# EAGLE design i2c-sensor-bridge (EAGLE 7.4.0)
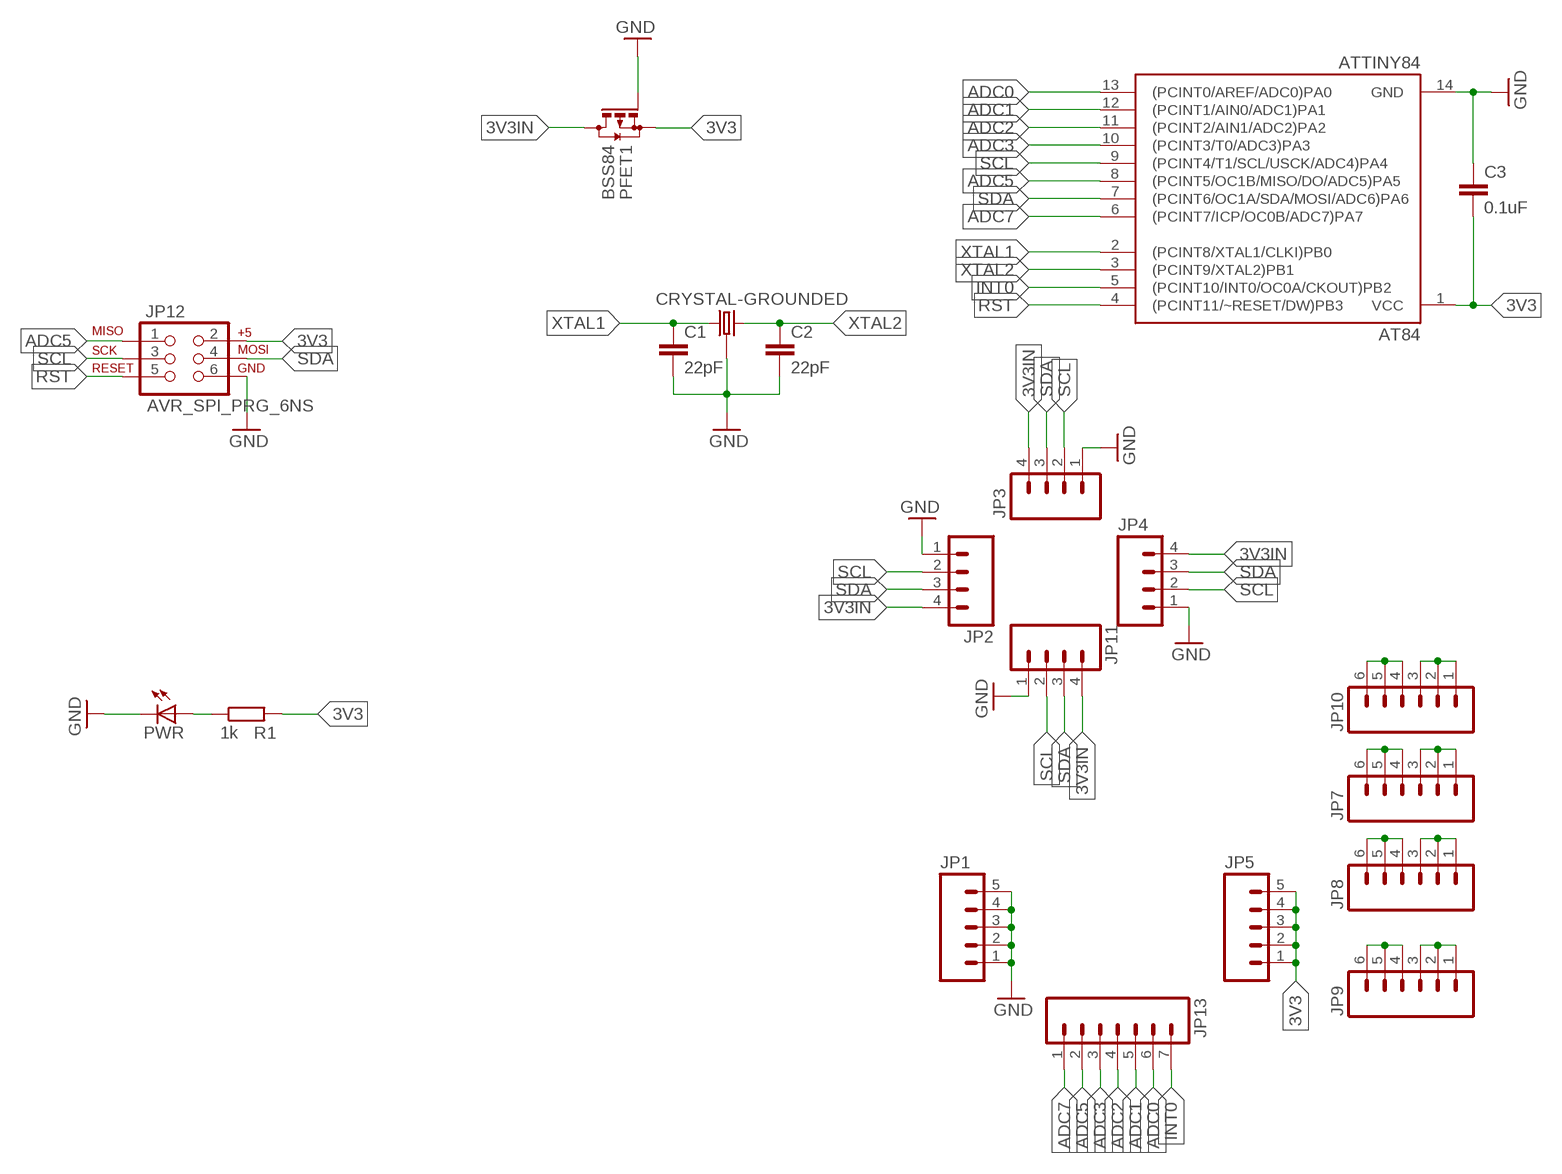
[diagram p0: schematic, sheet 1]

## Parts
AT84  ATTINY84  [SO14]
C1  22pF  C-EUC0805  [C0805]
C2  22pF  C-EUC0805  [C0805]
C3  0.1uF  C-EUC0805  [C0805]
CRYSTAL  CRYSTAL-GROUNDED  [CRYSTAL-SMD-5X3]
JP1  M05LOCK  [1X05_LOCK]
JP2  M04LOCK  [1X04_LOCK]
JP3  M04LOCK  [1X04_LOCK]
JP4  M04LOCK  [1X04_LOCK]
JP5  M05LOCK  [1X05_LOCK]
JP7  M06NO_SILK_FEMALE_PTH  [1X06_NO_SILK]
JP8  M06NO_SILK_FEMALE_PTH  [1X06_NO_SILK]
JP9  M06NO_SILK_FEMALE_PTH  [1X06_NO_SILK]
JP10  M06NO_SILK_FEMALE_PTH  [1X06_NO_SILK]
JP11  M04LOCK  [1X04_LOCK]
JP12  AVR_SPI_PRG_6NS  [2X3-NS]
JP13  M07LOCK  [1X07_LOCK]
PFET1  BSS84  [SOT23]
PWR  LEDCHIPLED_0805  [CHIPLED_0805]
R1  1k  R-EU_R0805  [R0805]

## Nets
3V3 [vreg]: AT84.1(VCC) C3.2 JP5.1 JP5.2 JP5.3 JP5.4 JP5.5 JP12.2 PFET1.2(S) R1.2
3V3IN: JP2.4 JP3.4 JP4.4 JP11.4 PFET1.3(D)
ADC0: AT84.13((PCINT0/AREF/ADC0)PA0) JP13.6
ADC1: AT84.12((PCINT1/AIN0/ADC1)PA1) JP13.5
ADC2: AT84.11((PCINT2/AIN1/ADC2)PA2) JP13.4
ADC3: AT84.10((PCINT3/T0/ADC3)PA3) JP13.3
ADC5: AT84.8((PCINT5/OC1B/MISO/DO/ADC5)PA5) JP12.1 JP13.2
ADC7: AT84.6((PCINT7/ICP/OC0B/ADC7)PA7) JP13.1
GND: AT84.14(GND) C1.2 C2.2 C3.1 CRYSTAL.2 CRYSTAL.4 JP1.1 JP1.2 JP1.3 JP1.4 JP1.5 JP2.1 JP3.1 JP4.1 JP11.1 JP12.6 PFET1.1(G) PWR.C
INT0: AT84.5((PCINT10/INT0/OC0A/CKOUT)PB2) JP13.7
N$1: PWR.A R1.1
N$2 [vreg]: JP10.4 JP10.5 JP10.6
N$3 [vreg]: JP10.1 JP10.2 JP10.3
N$4 [vreg]: JP7.1 JP7.2 JP7.3
N$5 [vreg]: JP7.4 JP7.5 JP7.6
N$6 [vreg]: JP8.4 JP8.5 JP8.6
N$7 [vreg]: JP8.1 JP8.2 JP8.3
N$8 [vreg]: JP9.1 JP9.2 JP9.3
N$9 [vreg]: JP9.4 JP9.5 JP9.6
RST: AT84.4((PCINT11/~RESET/DW)PB3) JP12.5
SCL: AT84.9((PCINT4/T1/SCL/USCK/ADC4)PA4) JP2.2 JP3.2 JP4.2 JP11.2 JP12.3
SDA: AT84.7((PCINT6/OC1A/SDA/MOSI/ADC6)PA6) JP2.3 JP3.3 JP4.3 JP11.3 JP12.4
XTAL1: AT84.2((PCINT8/XTAL1/CLKI)PB0) C1.1 CRYSTAL.3
XTAL2: AT84.3((PCINT9/XTAL2)PB1) C2.1 CRYSTAL.1

## Library data of the parts
AT84 = SparkFun-DigitalIC:ATTINY84: Atmel 14-pin 2/4/8kB flash uC; PROD_ID: IC-11285
C1-C3 = rcl:C-EU: CAPACITOR, European symbol
CRYSTAL = SparkFun-FreqCtrl:CRYSTAL-GROUNDED
JP1 JP5 = SparkFun-Connectors:M05: Header 5 Standard 5-pin 0.1" header. Use with straight break away headers (SKU : PRT-00116), right angle break away headers (PRT-00553), swiss pins (PRT-00743), machine pins (PRT-00117), and female headers (PRT-00115). Molex polarized connector foot print use with SKU : PRT-08230 with associated crimp pins and housings.
JP2-JP4 JP11 = SparkFun-Connectors:M04: Header 4 Standard 4-pin 0.1" header. Use with straight break away headers (SKU : PRT-00116), right angle break away headers (PRT-00553), swiss pins (PRT-00743), machine pins (PRT-00117), and female headers (PRT-00115). Molex polarized connector foot print use with SKU : PRT-08231 with associated crimp pins and housings. 1MM SMD Version SKU: PRT-10208
JP7-JP10 = SparkFun-Connectors:M06: Header 6 Standard 6-pin 0.1" header. Use with straight break away headers (SKU : PRT-00116), right angle break away headers (PRT-00553), swiss pins (PRT-00743), machine pins (PRT-00117), and female headers (PRT-00115). Molex polarized connector foot print use with SKU : PRT-08094 with associated crimp pins and housings. NOTES ON THE VARIANTS LOCK and LOCK_LONGPADS... This footprint was designed to help hold the alignment of a through-hole component (i.e. 6-pin header) while soldering it into place. You may notice that each hole has been shifted either up or down by 0.005 of an inch from it's more standard position (which is a perfectly straight line). This slight alteration caused the pins (the squares in the middle) to touch the edges of the holes. Because they are alternating, it causes a "brace" to hold the component in place. 0.005 has proven to be the perfect amount of "off-center" position when using our standard breakaway headers. Although looks a little odd when you look at the bare footprint, once you have a header in there, the alteration is very hard to notice. Also,if you push a header all the way into place, it is covered up entirely on the bottom side. This idea of altering the position of holes to aid alignment will be further integrated into the Sparkfun Library for other footprints. It can help hold any component with 3 or more connection pins.; PROD_ID: CONN-08437
JP12 = SparkFun-Connectors:AVR_SPI_PRG_6: AVR ISP 6 Pin This is the reduced ISP connector for AVR programming. Common on Arduino. This footprint will take up less PCB space and can be used with a 10-pin to 6-pin adapter such as SKU: BOB-08508 **Special note about "TEST_POINT" package. The stop mask is on the top side, so if you want your programming test points to be on the bottom of your board, make sure to place this package on the bottom side of the board. This also ensure that the orientation to program from the bottom side will be correct.
JP13 = SparkFun-Connectors:M07: Header 7 Standard 7-pin 0.1" header. Use with straight break away headers (SKU : PRT-00116), right angle break away headers (PRT-00553), swiss pins (PRT-00743), machine pins (PRT-00117), and female headers (PRT-00115). NOTES ON THE VARIANTS LOCK and LOCK_LONGPADS... This footprint was designed to help hold the alignment of a through-hole component (i.e. 7-pin header) while soldering it into place. You may notice that each hole has been shifted either up or down by 0.005 of an inch from it's more standard position (which is usually a perfectly straight line). This slight alteration caused the pins (the squares in the middle) to touch the edges of the holes. Because they are alternating, it causes a "brace" to hold the header in place. 0.005 has proven to be the perfect amount of "off-center" position when using our standard breakaway headers. Although looks a little odd when you look at the bare footprint, once you have a header in there, the alteration is very hard to notice. Also, if you push a header all the way into place, it is covered up entirely on the bottom side. This idea of altering the position of holes to aid alignment will be further integrated into the Sparkfun Library for other footprints. It can help hold any component with 3 or more connection pins.
PFET1 = transistor-small-signal:BSS84: P-CHANNEL MOS FET
PWR = adafruit:LED: LED OSRAM: - CHIPLED LG R971, LG N971, LY N971, LG Q971, LY Q971, LO R971, LY R971 LH N974, LH R974 LS Q976, LO Q976, LY Q976 LO Q996 - Hyper CHIPLED LW Q18S LB Q993, LB Q99A, LB R99A - SideLED LS A670, LO A670, LY A670, LG A670, LP A670 LB A673, LV A673, LT A673, LW A673 LH A674 LY A675 LS A676, LA A676, LO A676, LY A676, LW A676 LS A679, LY A679, LG A679 - Hyper Micro SIDELED® LS Y876, LA Y876, LO Y876, LY Y876 LT Y87S - SmartLED LW L88C, LW L88S LB L89C, LB L89S, LG L890 LS L89K, LO L89K, LY L89K LS L896, LA L896, LO L896, LY L896 - TOPLED LS T670, LO T670, LY T670, LG T670, LP T670 LSG T670, LSP T670, LSY T670, LOP T670, LYG T670 LG T671, LOG T671, LSG T671 LB T673, LV T673, LT T673, LW T673 LH T674 LS T676, LA T676, LO T676, LY T676, LB T676, LH T676, LSB T676, LW T676 LB T67C, LV T67C, LT T67C, LS T67K, LO T67K, LY T67K, LW E67C LS E67B, LA E67B, LO E67B, LY E67B, LB E67C, LV E67C, LT E67C LW T67C LS T679, LY T679, LG T679 LS T770, LO T770, LY T770, LG T770, LP T770 LB T773, LV T773, LT T773, LW T773 LH T774 LS E675, LA E675, LY E675, LS T675 LS T776, LA T776, LO T776, LY T776, LB T776 LHGB T686 LT T68C, LB T68C - Hyper Mini TOPLED® LB M676 - Mini TOPLED Santana® LG M470 LS M47K, LO M47K, LY M47K Source: http://www.osram.convergy.de/
R1 = resistor:R-EU_: RESISTOR, European symbol

## Net classes
1 vcc: width 0.406 mm
2 vreg: width 0.406 mm

## Board
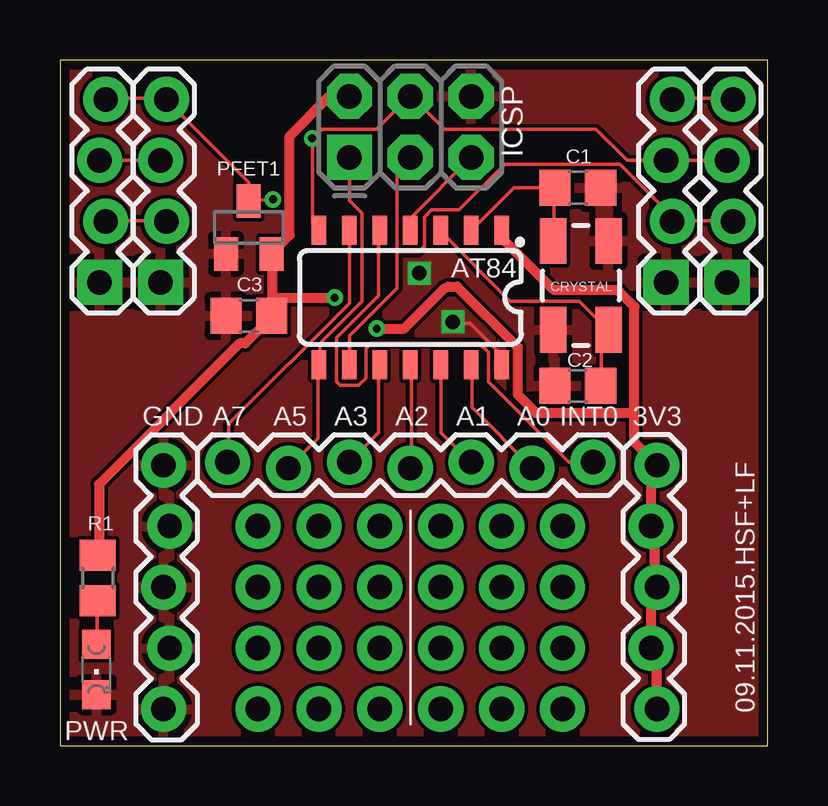
[diagram p1: board, top side]
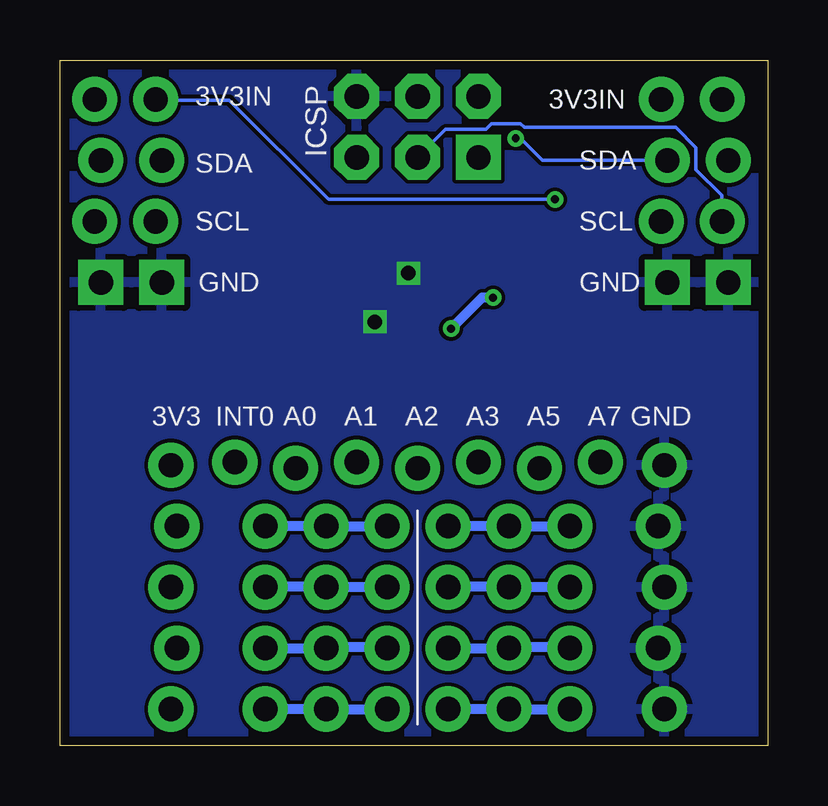
[diagram p2: board, bottom side, seen from below]

Size 29.52 x 28.57 mm. Coordinates in mm from the lower left corner, seen from the top.
Outline: 0,0 29.52,0 29.52,28.57 0,28.56 0,0
Copper layers (1*16): Top 0.0356mm / dielectric 1.5011mm / Bottom 0.0356mm
Design rules "LaenPCBOrder": minimum track width 6mil, minimum drill 13mil, track to track 6mil, track to pad 6mil, pad to pad 6mil, via to via 6mil, smd to smd 6mil, copper to edge 15mil, drill to drill 6mil, minimum pad ring 7mil, minimum via ring 7mil, stop-mask expansion 3mil, vias tented up to drill 0mil, thermal gap 10mil

### Footprints (pad centres in the part's own frame; a part is rotated, then mirrored left to right if it is on the bottom)
SO14 = smd 0.6 x 1.2: 1 -3.81,-2.8; 2 -2.54,-2.8; 3 -1.27,-2.8; 4 0,-2.8; 5 1.27,-2.8; 6 2.54,-2.8; 7 3.81,-2.8; 8 3.81,2.8; 9 2.54,2.8; 10 1.27,2.8; 11 0,2.8; 12 -1.27,2.8; 13 -2.54,2.8; 14 -3.81,2.8
C0805 = smd 1.3 x 1.5: 1 -0.95,0; 2 0.95,0
CRYSTAL-SMD-5X3 = smd 1.9 x 1.1: 1 -1.85,-1.15; 2 1.85,-1.15; 3 1.85,1.15; 4 -1.85,1.15
1X05_LOCK = drill 1.016 pad 1.88: 1 0,0.127; 2 2.54,-0.127; 3 5.08,0.127; 4 7.62,-0.127; 5 10.16,0.127
1X04_LOCK = drill 1.016 pad 1.88 square: 1 0,0.127 | drill 1.016 pad 1.88: 2 2.54,-0.127; 3 5.08,0.127; 4 7.62,-0.127
1X06_NO_SILK = drill 1.016 pad 1.88: 1 0,0; 2 2.54,0; 3 5.08,0; 4 7.62,0; 5 10.16,0; 6 12.7,0
2X3-NS = drill 1.016 pad 1.88 square: 1 -2.54,-1.27 | drill 1.016 pad 1.88 octagon: 2 -2.54,1.27; 3 0,-1.27; 4 0,1.27; 5 2.54,-1.27; 6 2.54,1.27
1X07_LOCK = drill 1.016 pad 1.88: 1 0,0.127; 2 2.54,-0.127; 3 5.08,0.127; 4 7.62,-0.127; 5 10.16,0.127; 6 12.7,-0.127; 7 15.24,0.127
SOT23 = smd 1 x 1.4: 1 -0.95,-1.1; 2 0.95,-1.1; 3 0,1.1
CHIPLED_0805 = smd 1.2 x 1.2: A 0,-1.05; C 0,1.05
R0805 = smd 1.3 x 1.5: 1 -0.95,0; 2 0.95,0

### Placement (x,y rotation side)
AT84  14.61,18.67 180 top
C1  21.59,23.24 0 top
C2  21.59,14.99 180 top
C3  7.87,17.91 0 top
CRYSTAL  21.72,19.18 90 top
JP1  4.45,1.52 90 top
JP2  4.32,19.3 90 top
JP3  1.78,19.3 90 top
JP4  27.94,19.3 90 top
JP5  24.77,11.68 270 top
JP7  8.25,9.14 0 top
JP8  8.25,6.6 0 top
JP9  8.25,4.06 0 top
JP10  8.25,1.52 0 top
JP11  25.4,19.3 90 top
JP12  14.61,25.78 0 top
JP13  6.98,11.68 0 top
PFET1  7.87,21.59 0 top
PWR  1.52,3.17 180 top
R1  1.57,6.98 90 top

### Tracks (layer width: path | path; a pad name or v marks a point on that pad's centre or on a via)
3V3  (via drill 0.33)
  Top 0.406: JP5.5 24.87,1.52 24.87,3.73 24.71,3.89 JP5.4 24.64,6.32 24.87,6.55 JP5.3 24.79,6.78 24.79,9.07 JP5.2 24.64,11.35 24.79,11.51 JP5.1 24.87,11.73 23.95,12.65 23.95,13.87 | 23.95,13.87 23.95,18.29 23.27,18.97 20.6,18.97 18.47,21.11 18.47,21.41 AT84.1 | 8.86,18.67 8.86,17.91 C3.2 8.71,17.75 7.72,16.76 7.49,16.76 1.63,10.9 1.63,7.7 R1.2 | 8.86,18.67 8.86,20.42 PFET1.2 9.58,21.28 9.58,25.4 11.23,27.05 JP12.2 | 23.95,13.87 19.84,13.87 19.07,14.63 19.07,16.61 16.56,19.13 16.18,19.13 16.03,19.05 14.35,17.37 v13.21,17.37 | 8.86,18.67 v11.45,18.67
  Bottom 0.406: v13.21,17.37 11.91,18.67 v11.45,18.67
3V3IN  (via drill 0.33)
  Top 0.152: JP11.4 25.55,26.97 28.07,26.97 JP4.4 | JP3.4 1.93,26.97 4.45,26.97 JP2.4 4.45,26.9 7.87,23.47 PFET1.3 v8.88,22.76 | 25.48,26.9 JP11.4 | 25.4,26.9 JP11.4
  Bottom 0.152: v8.88,22.76 18.29,22.76 18.34,22.78 22.45,26.9 25.4,26.9 JP11.4 25.48,26.9
ADC0
  Top 0.152: AT84.13 17.17,15.85 17.17,14.1 19.68,11.58 JP13.6
ADC1
  Top 0.152: AT84.12 15.88,13.03 17.09,11.81 JP13.5
ADC2
  Top 0.152: AT84.11 14.66,15.85 14.66,11.58 JP13.4
ADC3
  Top 0.152: JP13.3 13.28,13.03 13.28,15.85 AT84.10
ADC5
  Top 0.152: JP13.2 10.77,12.8 10.77,15.85 AT84.8 10.85,15.93 10.85,16.76 12.6,18.52 12.6,22.17 12.06,22.71 JP12.1
ADC7
  Top 0.152: JP13.1 7.04,11.81 7.04,13.41 12.06,18.44 AT84.6
GND  (via drill 0.6)
  Top 0.152: AT84.14 18.39,15.93 18.39,16.31 17.09,17.6 16.41,17.6 v16.38,17.65
  other vias: 14.99,19.69
  pour Bottom: -8.89,34.92 38.1,34.92 38.1,-10.8 -8.89,-10.8
  pour Top: -8.89,-10.8 38.1,-10.8 38.1,34.92 -8.89,34.92
INT0
  Top 0.152: JP13.7 21.21,11.81 17.86,15.16 17.86,16.38 17.47,16.76 12.98,16.76 12.75,16.53 12.75,15.32 12.45,15.01 11.68,15.01 11.53,15.16 11.53,16.99 13.28,18.75 13.28,21.41 AT84.5
N$1
  Top 0.152: PWR.A 1.55,4.27 1.55,5.71 R1.1
N$2
  Bottom 0.406: JP10.4 JP10.5 JP10.6
N$3
  Bottom 0.406: JP10.1 JP10.2 JP10.3
N$4
  Bottom 0.406: JP7.1 JP7.2 JP7.3
N$5
  Bottom 0.406: JP7.4 JP7.5 JP7.6
N$6
  Bottom 0.406: JP8.4 15.88,6.63 18.39,6.63 JP8.5 18.54,6.63 20.9,6.63 JP8.6
N$7
  Bottom 0.406: JP8.1 8.25,6.63 10.77,6.63 JP8.2 10.92,6.63 13.28,6.63 JP8.3
N$8
  Bottom 0.406: JP9.1 8.25,4.11 10.77,4.11 JP9.2 11,4.04 13.28,4.04 JP9.3
N$9
  Bottom 0.406: JP9.4 15.88,4.11 18.39,4.11 JP9.5 18.62,4.04 20.9,4.04 JP9.6
RST
  Top 0.152: JP12.5 14.66,22.02 14.66,21.49 AT84.4
SCL
  Top 0.152: JP4.2 28.07,21.87 25.55,21.87 JP11.2 25.48,21.87 25.48,22.1 23.34,24.23 18.54,24.23 16.64,22.33 15.49,22.33 15.19,22.02 15.19,20.8 14.96,20.57 14.05,20.57 | JP3.2 1.93,21.87 4.45,21.87 JP2.2 | AT84.9 12.06,17.07 14.05,19.05 14.05,20.57 | 14.05,20.57 14.05,23.93 14.58,24.46 JP12.3
  Bottom 0.152: JP12.3 13.44,25.68 11.76,25.68 11.53,25.91 10.31,25.91 10.16,25.76 3.83,25.76 3,24.92 3,24 1.93,22.94 1.93,21.87 JP3.2
SDA  (via drill 0.33)
  Top 0.152: JP4.3 JP11.3 23.65,24.38 22.35,25.68 16.03,25.68 14.66,27.05 JP12.4 14.58,27.05 13.21,25.68 10.92,25.68 10.54,25.3 | JP2.3 JP3.3 | 10.77,21.49 AT84.7 10.77,21.56 10.54,21.79 10.54,25.3 | 10.54,25.3 v10.52,25.3
  Bottom 0.152: 10.54,25.3 v10.52,25.3 | 10.54,25.38 v10.52,25.3 | 10.46,25.38 v10.52,25.3 | JP2.3 9.4,24.38 10.39,25.38 v10.52,25.3
XTAL1
  Top 0.152: 20.6,23.24 18.92,23.24 17.17,21.49 AT84.2 | 20.6,23.24 20.6,21.03 CRYSTAL.3 | 20.6,23.24 C1.1
XTAL2
  Top 0.152: AT84.3 15.88,21.41 18.77,18.52 21.67,18.52 22.81,17.37 CRYSTAL.1 22.81,17.3 22.58,17.07 22.58,15.01 C2.1

### Text on the board
tNames: ICSP | GND | A7 | A5 | A3 | A2 | A1 | A0 | INT0 | 3V3 | 09.11.2015.HSF+LF
bNames: 3V3IN | 3V3IN | ICSP | SDA | SDA | SCL | SCL | GND | GND | GND | A7 | A5 | A3 | A2 | A1 | A0 | INT0 | 3V3